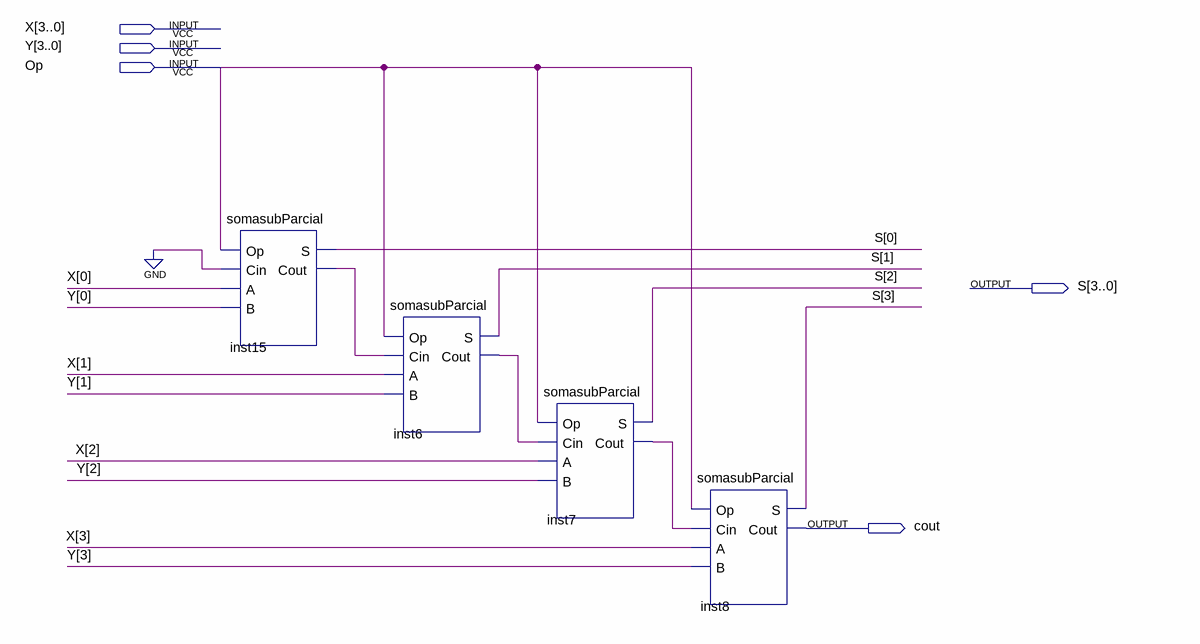
[diagram p0: schematic sheet]
// Quartus schematic somasub.bdf as structural Verilog: 4 symbols, 5 pins
module somasub (
  input  [3:0] X,
  input  [3:0] Y,
  input  Op,
  output [3:0] S,
  output cout
);

  wire inst6_cout, inst7_cout, inst15_cout;

  somasubParcial inst15 (.Op(Op), .Cin(1'b0), .A(X[0]), .B(Y[0]), .S(S[0]), .Cout(inst15_cout));
  somasubParcial inst6 (.Op(Op), .Cin(inst15_cout), .A(X[1]), .B(Y[1]), .S(S[1]), .Cout(inst6_cout));
  somasubParcial inst7 (.Op(Op), .Cin(inst6_cout), .A(X[2]), .B(Y[2]), .S(S[2]), .Cout(inst7_cout));
  somasubParcial inst8 (.Op(Op), .Cin(inst7_cout), .A(X[3]), .B(Y[3]), .S(S[3]), .Cout(cout));
endmodule
